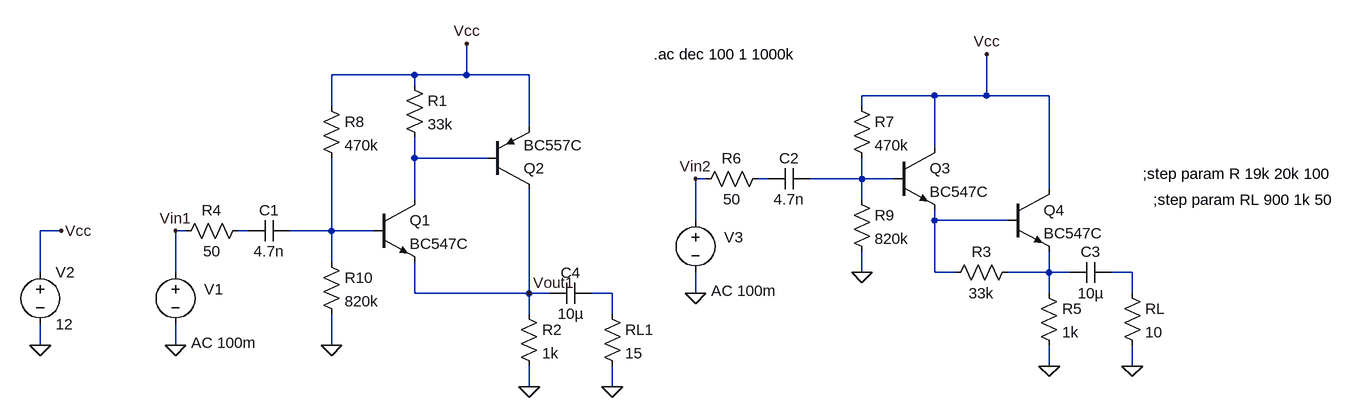
[diagram p0: schematic Sziklai and Darlington.asc]
Sziklai and Darlington.asc, the LTspice schematic file:
Version 4
SHEET 1 1764 1044
WIRE 240 -16 112 -16
WIRE 320 -16 320 -64
WIRE 320 -16 240 -16
WIRE 416 -16 320 -16
WIRE 240 0 240 -16
WIRE 1040 16 928 16
WIRE 1120 16 1120 -48
WIRE 1120 16 1040 16
WIRE 1216 16 1120 16
WIRE 112 32 112 -16
WIRE 928 32 928 16
WIRE 416 64 416 -16
WIRE 1040 96 1040 16
WIRE 240 112 240 80
WIRE 352 112 240 112
WIRE 688 144 672 144
WIRE 784 144 768 144
WIRE 928 144 928 112
WIRE 928 144 848 144
WIRE 976 144 928 144
WIRE 1216 160 1216 16
WIRE 240 176 240 112
WIRE 928 176 928 144
WIRE 672 208 672 144
WIRE 1040 208 1040 192
WIRE 1152 208 1040 208
WIRE -304 224 -336 224
WIRE -112 224 -128 224
WIRE -16 224 -32 224
WIRE 112 224 112 112
WIRE 112 224 48 224
WIRE 176 224 112 224
WIRE 112 272 112 224
WIRE -336 288 -336 224
WIRE -128 288 -128 224
WIRE 928 288 928 256
WIRE 1040 288 1040 208
WIRE 1072 288 1040 288
WIRE 1216 288 1216 256
WIRE 1216 288 1152 288
WIRE 1248 288 1216 288
WIRE 1344 288 1312 288
WIRE 240 320 240 272
WIRE 416 320 416 160
WIRE 416 320 240 320
WIRE 448 320 416 320
WIRE 544 320 512 320
WIRE 672 320 672 288
WIRE 1216 320 1216 288
WIRE 1344 320 1344 288
WIRE 416 352 416 320
WIRE 544 352 544 320
WIRE -336 400 -336 368
WIRE -128 400 -128 368
WIRE 112 400 112 352
WIRE 1216 432 1216 400
WIRE 1344 432 1344 400
WIRE 416 464 416 432
WIRE 544 464 544 432
FLAG -128 400 0
FLAG 416 464 0
FLAG -336 400 0
FLAG -304 224 Vcc
FLAG 320 -64 Vcc
FLAG 672 320 0
FLAG 1216 432 0
FLAG 1120 -48 Vcc
FLAG -128 224 Vin1
FLAG 672 144 Vin2
FLAG 416 320 Vout1
FLAG 928 288 0
FLAG 1344 432 0
FLAG 544 464 0
FLAG 112 400 0
SYMBOL npn 176 176 R0
SYMATTR InstName Q1
SYMATTR Value BC547C
SYMBOL pnp 352 160 M180
SYMATTR InstName Q2
SYMATTR Value BC557C
SYMBOL res 224 -16 R0
SYMATTR InstName R1
SYMATTR Value 33k
SYMBOL voltage -128 272 R0
WINDOW 0 44 42 Left 2
WINDOW 123 24 124 Left 2
WINDOW 39 0 0 Left 0
SYMATTR InstName V1
SYMATTR Value2 AC 100m
SYMATTR Value ""
SYMBOL voltage -336 272 R0
WINDOW 123 0 0 Left 0
WINDOW 39 0 0 Left 0
SYMATTR InstName V2
SYMATTR Value 12
SYMBOL res 400 336 R0
SYMATTR InstName R2
SYMATTR Value 1k
SYMBOL cap 48 208 R90
WINDOW 0 0 32 VBottom 2
WINDOW 3 32 32 VTop 2
SYMATTR InstName C1
SYMATTR Value 4.7n
SYMBOL res -16 208 R90
WINDOW 0 0 56 VBottom 2
WINDOW 3 32 56 VTop 2
SYMATTR InstName R4
SYMATTR Value 50
SYMBOL npn 976 96 R0
SYMATTR InstName Q3
SYMATTR Value BC547C
SYMBOL res 1168 272 R90
WINDOW 0 0 56 VBottom 2
WINDOW 3 32 56 VTop 2
SYMATTR InstName R3
SYMATTR Value 33k
SYMBOL voltage 672 192 R0
WINDOW 0 44 42 Left 2
WINDOW 123 24 124 Left 2
WINDOW 39 0 0 Left 0
SYMATTR InstName V3
SYMATTR Value2 AC 100m
SYMATTR Value ""
SYMBOL res 1200 304 R0
SYMATTR InstName R5
SYMATTR Value 1k
SYMBOL cap 848 128 R90
WINDOW 0 0 32 VBottom 2
WINDOW 3 32 32 VTop 2
SYMATTR InstName C2
SYMATTR Value 4.7n
SYMBOL res 784 128 R90
WINDOW 0 0 56 VBottom 2
WINDOW 3 32 56 VTop 2
SYMATTR InstName R6
SYMATTR Value 50
SYMBOL npn 1152 160 R0
SYMATTR InstName Q4
SYMATTR Value BC547C
SYMBOL res 912 16 R0
SYMATTR InstName R7
SYMATTR Value 470k
SYMBOL res 96 16 R0
SYMATTR InstName R8
SYMATTR Value 470k
SYMBOL res 912 160 R0
SYMATTR InstName R9
SYMATTR Value 820k
SYMBOL res 1328 304 R0
SYMATTR InstName RL
SYMATTR Value 10
SYMBOL cap 1312 272 R90
WINDOW 0 0 32 VBottom 2
WINDOW 3 32 32 VTop 2
SYMATTR InstName C3
SYMATTR Value 10µ
SYMBOL cap 512 304 R90
WINDOW 0 0 32 VBottom 2
WINDOW 3 32 32 VTop 2
SYMATTR InstName C4
SYMATTR Value 10µ
SYMBOL res 528 336 R0
SYMATTR InstName RL1
SYMATTR Value 15
SYMBOL res 96 256 R0
SYMATTR InstName R10
SYMATTR Value 820k
TEXT 608 -48 Left 2 !.ac dec 100 1 1000k
TEXT 1360 136 Left 2 !;step param R 19k 20k 100
TEXT 1376 176 Left 2 !;step param RL 900 1k 50

The netlist it stands for:
* Sziklai and Darlington.asc
Q1 N001 N006 Vout1 0 BC547C
Q2 Vout1 N001 Vcc 0 BC557C
R1 Vcc N001 33k
V1 Vin1 0 AC 100m
V2 Vcc 0 12
R2 Vout1 0 1k
C1 N006 N005 4.7n
R4 N005 Vin1 50
Q3 Vcc N003 N004 0 BC547C
R3 N007 N004 33k
V3 Vin2 0 AC 100m
R5 N007 0 1k
C2 N003 N002 4.7n
R6 N002 Vin2 50
Q4 Vcc N004 N007 0 BC547C
R7 Vcc N003 470k
R8 Vcc N006 470k
R9 N003 0 820k
RL N008 0 10
C3 N008 N007 10µ
C4 N009 Vout1 10µ
RL1 N009 0 15
R10 N006 0 820k
.model NPN NPN
.model PNP PNP
.lib standard.bjt
.ac dec 100 1 1000k
;step param R 19k 20k 100
;step param RL 900 1k 50
.backanno
.end